# EAGLE design cooling_system (EAGLE 8.4.0)
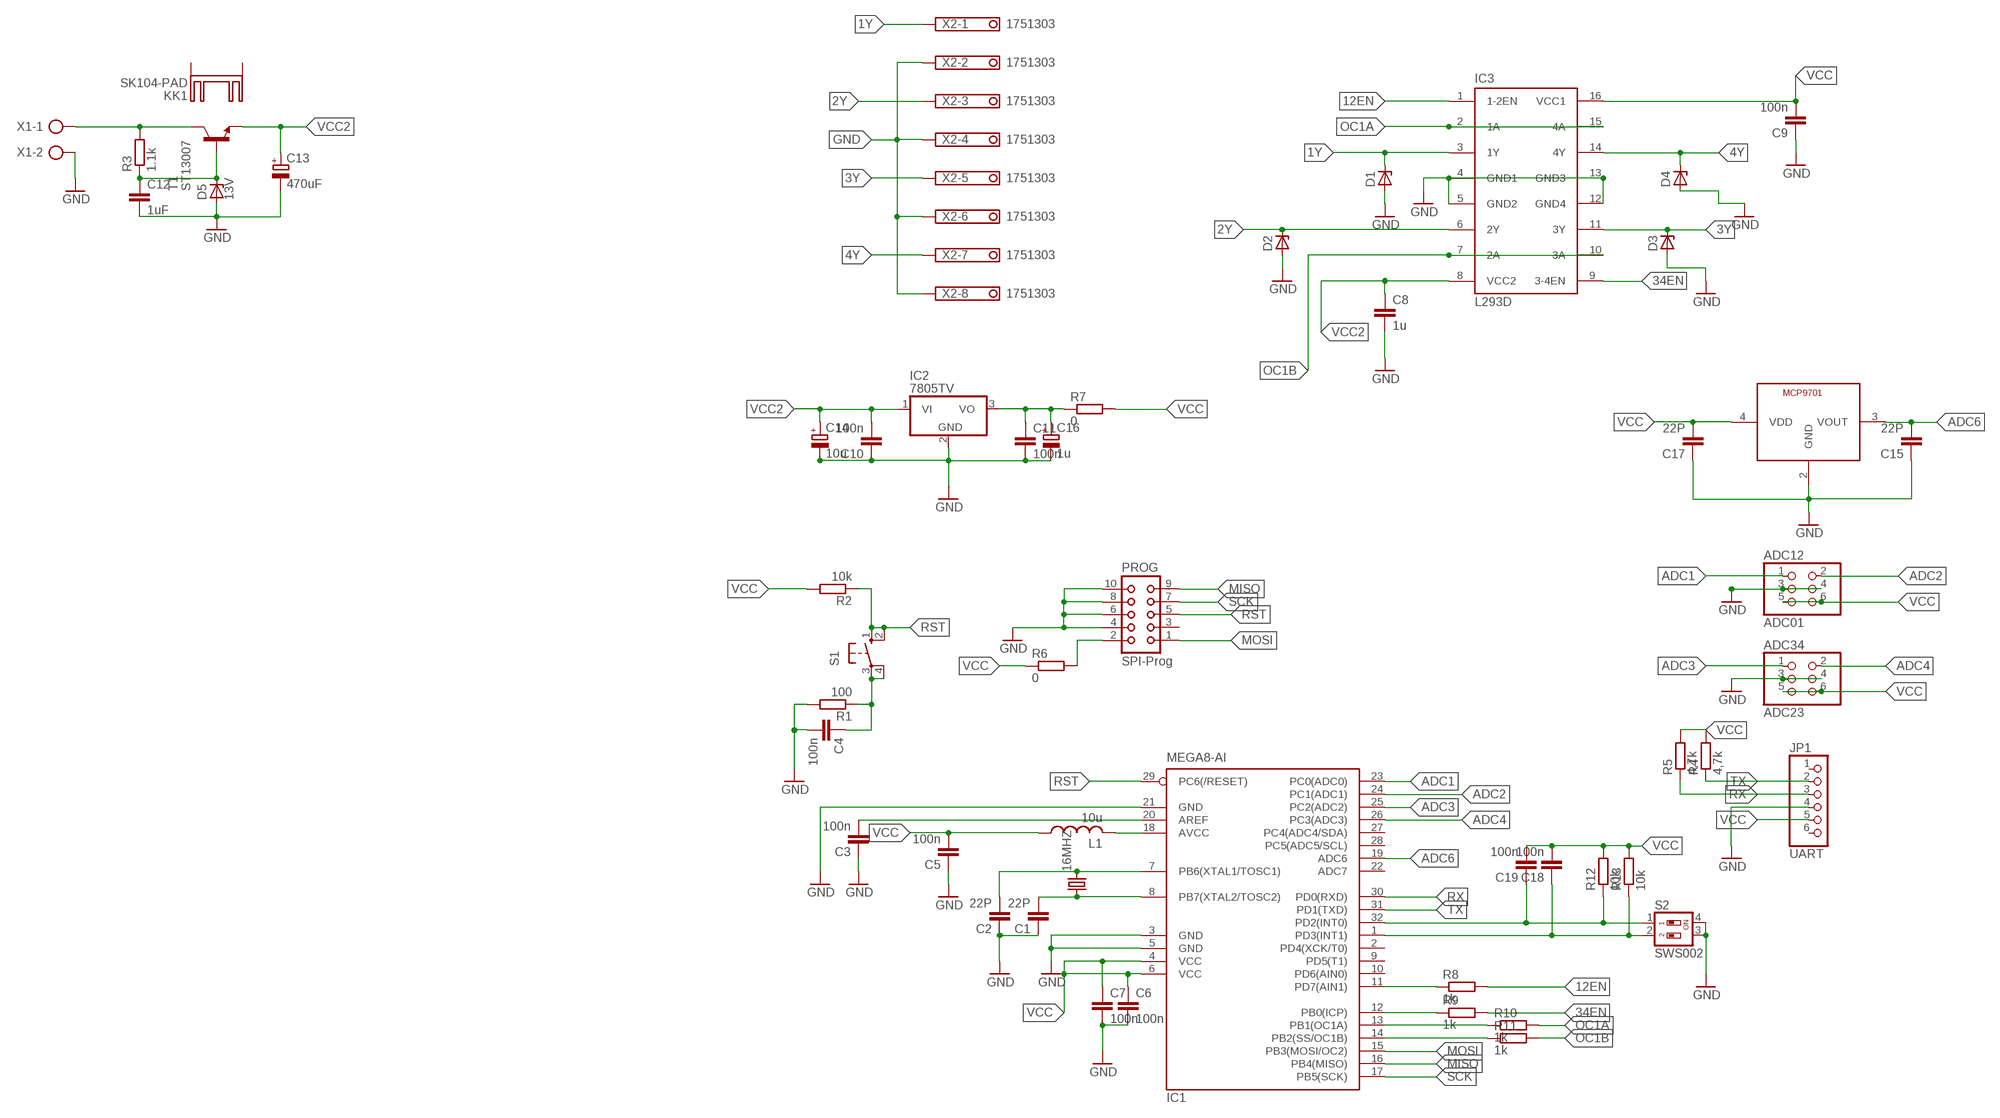
[diagram p0: schematic, sheet 1]

## Parts
16MHZ  CRYSTALHC18U-V  [HC18U-V]
ADC12  ADC01  PINHD-2X3  [2X03]
ADC34  ADC23  PINHD-2X3  [2X03]
C1  22P  C-EUC0805K  [C0805K]
C2  22P  C-EUC0805K  [C0805K]
C3  100n  C-EUC0805K  [C0805K]
C4  100n  C-EUC0805K  [C0805K]
C5  100n  C-EUC0805K  [C0805K]
C6  100n  C-EUC0805K  [C0805K]
C7  100n  C-EUC0805K  [C0805K]
C8  1u  C-EUC0805K  [C0805K]
C9  100n  C-EUC0805K  [C0805K]
C10  100n  C-EUC0805K  [C0805K]
C11  100n  C-EUC0805K  [C0805K]
C12  1uF  C-EUC0805K  [C0805K]
C13  470uF  CPOL-EUE5-10.5  [E5-10,5]
C14  10u  CPOL-EU153CLV-0505  [153CLV-0505]
C15  22P  C-EUC0805K  [C0805K]
C16  1u  CPOL-EU153CLV-0405  [153CLV-0405]
C17  22P  C-EUC0805K  [C0805K]
C18  100n  C-EUC0805K  [C0805K]
C19  100n  C-EUC0805K  [C0805K]
D1  ZENER-DIODEDO35Z10  [DO35Z10]
D2  ZENER-DIODEDO35Z10  [DO35Z10]
D3  ZENER-DIODEDO35Z10  [DO35Z10]
D4  ZENER-DIODEDO35Z10  [DO35Z10]
D5  13V  ZENER-DIODESOT23  [SOT23]
IC1  MEGA8-AI  [TQFP32-08]
IC2  7805TV  [TO220V]
IC3  L293D  [DIL16]
JP1  UART  PINHD-1X6  [1X06]
KK1  SK104-PAD  [SK104-PAD]
L1  10u  L-US0207/10  [0207/10]
PROG  SPI-Prog  CON10  [CON10]
R1  100  R-EU_0207/10  [0207/10]
R2  10k  R-EU_0207/10  [0207/10]
R3  1.1k  R-EU_R0805  [R0805]
R4  4,7k  R-EU_R0805  [R0805]
R5  4,7k  R-EU_R0805  [R0805]
R6  0  R-EU_R0805  [R0805]
R7  0  R-EU_R0805  [R0805]
R8  1k  R-EU_R0805  [R0805]
R9  1k  R-EU_R0805  [R0805]
R10  1k  R-EU_R0805  [R0805]
R11  1k  R-EU_R0805  [R0805]
R12  10k  R-EU_R0805  [R0805]
R13  10k  R-EU_R0805  [R0805]
S1  10-XX  [B3F-10XX]
S2  SWS002  [SMS-002]
T1  ST13007  2SC2509V  [TO220AV]
U$2  MCP9701  [SC70-5L]
X1  AK300/2  [AK300/2]
X2  1751303  [1751303]

## Nets
1Y: D1.C IC3.3(1Y) X2.1
2Y: D2.C IC3.6(2Y) X2.3
3Y: D3.C IC3.11(3Y) X2.5
4Y: D4.C IC3.14(4Y) X2.7
12EN: IC3.1(1-2EN) R8.2
34EN: IC3.9(3-4EN) R9.2
ADC1: ADC12.1 IC1.23(PC0(ADC0))
ADC2: ADC12.2 IC1.24(PC1(ADC1))
ADC3: ADC34.1 IC1.25(PC2(ADC2))
ADC4: ADC34.2 IC1.26(PC3(ADC3))
ADC6: C15.2 IC1.19(ADC6) U$2.3(VOUT)
AREF: C3.2 IC1.20(AREF)
AVCC: IC1.18(AVCC) L1.2
GND: ADC12.3 ADC12.4 ADC34.3 ADC34.4 C1.1 C2.1 C3.1 C4.2 C5.1 C6.2 C7.2 C8.2 C9.1 C10.1 C11.2 C12.2 C13.- C14.- C15.1 C16.- C17.1 D1.A D2.A D3.A D4.A D5.1(A) IC1.3(GND) IC1.5(GND) IC1.21(GND) IC2.2(GND) IC3.4(GND1) IC3.5(GND2) IC3.12(GND4) IC3.13(GND3) JP1.4 PROG.4 PROG.6 PROG.8 PROG.10 R1.2 S2.3 S2.4 U$2.2(GND) X1.2 X2.2 X2.4 X2.6 X2.8
MISO: IC1.16(PB4(MISO)) PROG.9
MOSI: IC1.15(PB3(MOSI/OC2)) PROG.1
N$1: 16MHZ.2 C2.2 IC1.7(PB6(XTAL1/TOSC1))
N$2: 16MHZ.1 C1.2 IC1.8(PB7(XTAL2/TOSC2))
N$3: IC1.14(PB2(SS/OC1B)) R11.1
N$4: IC1.13(PB1(OC1A)) R10.1
N$5: PROG.2 R6.2
N$6: C4.1 R1.1 S1.3(P) S1.4(P1)
N$7: R3.2 T1.2(C) X1.1
N$8: C12.1 D5.3(C) R3.1 T1.1(B)
N$9: IC1.12(PB0(ICP)) R9.1
N$10: IC1.11(PD7(AIN1)) R8.1
N$11: C19.1 IC1.32(PD2(INT0)) R12.1 S2.1
N$12: C18.1 IC1.1(PD3(INT1)) R13.1 S2.2
N$22: C11.1 C16.+ IC2.3(VO) R7.1
OC1A: IC3.2(1A) IC3.15(4A) R10.2
OC1B: IC3.7(2A) IC3.10(3A) R11.2
RST: IC1.29(PC6(/RESET)) PROG.5 R2.1 S1.1(S) S1.2(S1)
RX: IC1.30(PD0(RXD)) JP1.3 R5.1
SCK: IC1.17(PB5(SCK)) PROG.7
TX: IC1.31(PD1(TXD)) JP1.2 R4.1
VCC: ADC12.5 ADC12.6 ADC34.5 ADC34.6 C5.2 C6.1 C7.1 C9.2 C17.2 C18.2 C19.2 IC1.4(VCC) IC1.6(VCC) IC3.16(VCC1) JP1.5 L1.1 R2.2 R4.2 R5.2 R6.1 R7.2 R12.2 R13.2 U$2.4(VDD)
VCC2: C8.1 C10.2 C13.+ C14.+ IC2.1(VI) IC3.8(VCC2) T1.3(E)
Unconnected: IC1.2(PD4(XCK/T0)) IC1.9(PD5(T1)) IC1.10(PD6(AIN0)) IC1.22(ADC7) IC1.27(PC4(ADC4/SDA)) IC1.28(PC5(ADC5/SCL)) JP1.1 JP1.6 KK1.K1(K) KK1.K2(K) PROG.3

## Library data of the parts
16MHZ = crystal:CRYSTAL: CRYSTAL; OC_FARNELL: unknown; OC_NEWARK: unknown
ADC12 ADC34 = pinhead:PINHD-2X3: PIN HEADER
C1-C12 C15 C17-C19 = resistor:C-EU: CAPACITOR, European symbol
C13 C14 C16 = resistor:CPOL-EU: POLARIZED CAPACITOR, European symbol
D1-D5 = diode:ZENER-DIODE: Z-Diode
IC1 = atmel:MEGA8: MICROCONTROLLER 8 Kbytes FLASH, 1 kbytes SRAM, 512 bytes EEPROM, USART, 6-channel 10 bit ADC, 2-channel 8 bit ADC Pin compatible with Atmega48, ATMega88, ATMega168 Source: avr.lbr; MPN: ATMEGA8-16AU; OC_FARNELL: 9171371; OC_NEWARK: 73M8863
IC2 = linear:78*: Positive VOLTAGE REGULATOR Source: http://cache.national.com/ds/LM/LM78L05.pdf http://www.fairchildsemi.com/ds/LM/LM7805.pdf
IC3 = st-microelectronics:L293D: PUSH-PULL 4 CHANNEL DRIVER; MPN: L293D; OC_FARNELL: 9589619; OC_NEWARK: 56P8249
JP1 = pinhead:PINHD-1X6: PIN HEADER
KK1 = heatsink:SK104-PAD: HEATSINK manufacturer Fischer/distributor Buerklin
L1 = resistor:L-US: INDUCTOR, American symbol
PROG = con-harting:CON10: CONNECTOR; OC_FARNELL: unknown; OC_NEWARK: unknown
R1-R13 = resistor:R-EU_: RESISTOR, European symbol
S1 = switch-omron:10-XX: OMRON SWITCH; MPN: B3F-1000; OC_FARNELL: 176432; OC_NEWARK: 36M3542
S2 = smd-special:SWS002: SMD Dip Switch 2 pol.
T1 = transistor:2SC2509: NPN Epitaxial Planar Transistor RF Power Amplivier Source: www.Datasheet4U.com 2SC2905.pdf
U$2 = MCP9701T:MCP9701
X1 = con-ptr500:AK300/2: CONNECTOR; OC_FARNELL: unknown; OC_NEWARK: unknown
X2 = con-phoenix-350:1751303: MKDS 1/ 8-3,5 Printklemme Nennstrom: 10 A Bemessungsspannung: 160 V Raster: 3,5 mm Polzahl: 8 Montageart: Löten Anschlussart: Schraubanschluss Anschlussrichtung vom Leiter zur Platine: 0° Source: http://eshop.phoenixcontact.com .. .pdf; OC_FARNELL: unknown; OC_NEWARK: unknown

## Board
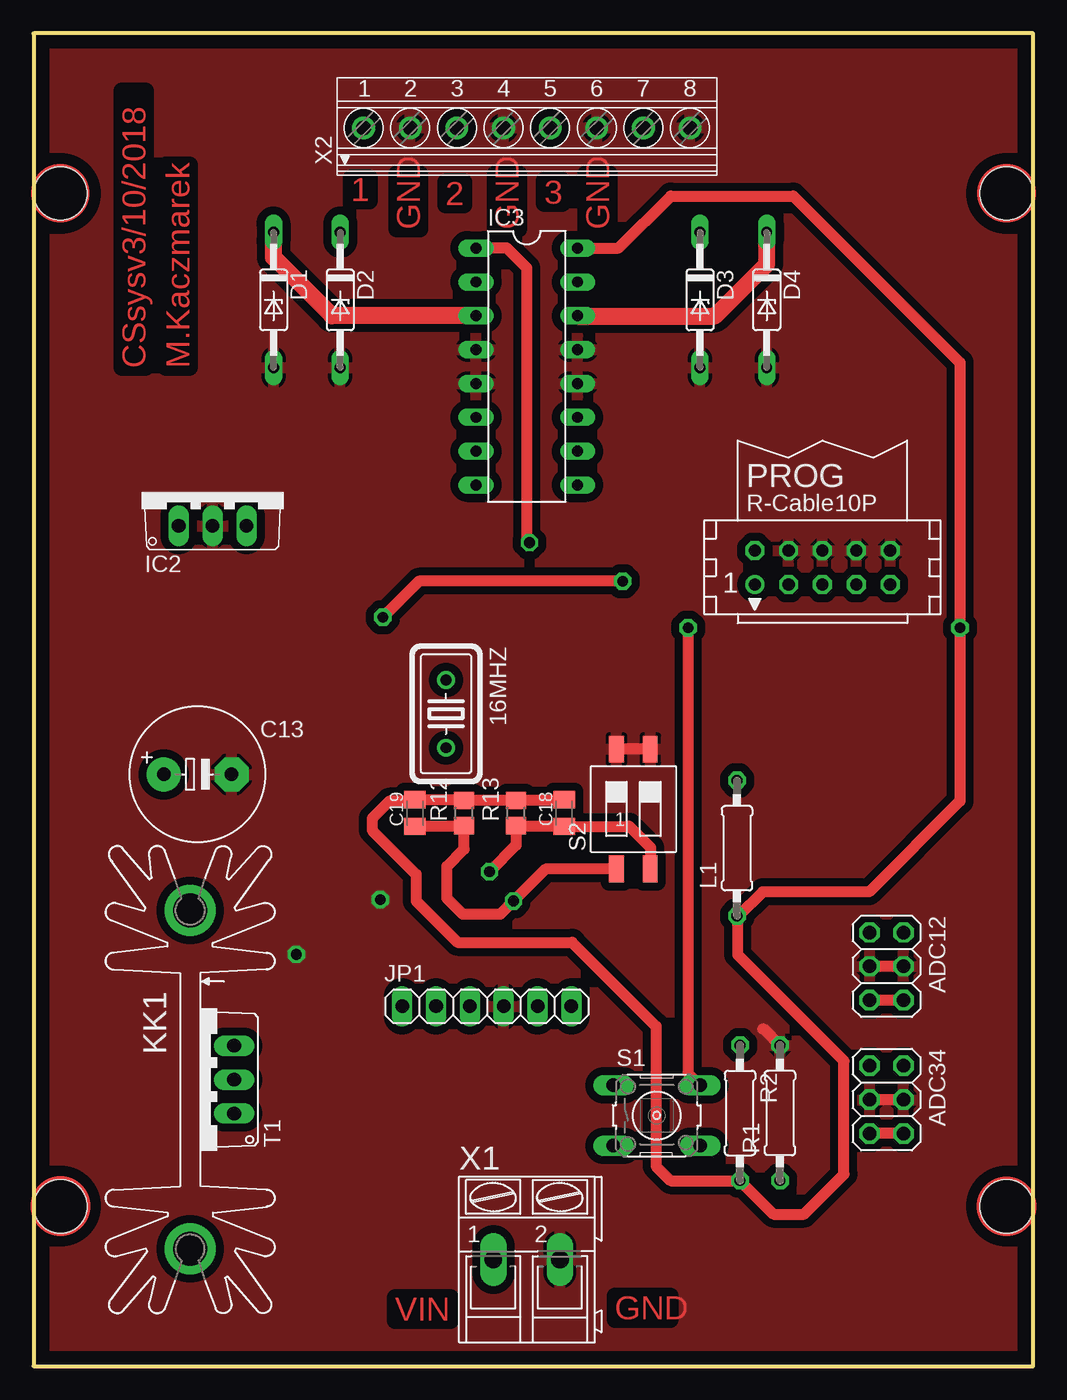
[diagram p1: board, top side]
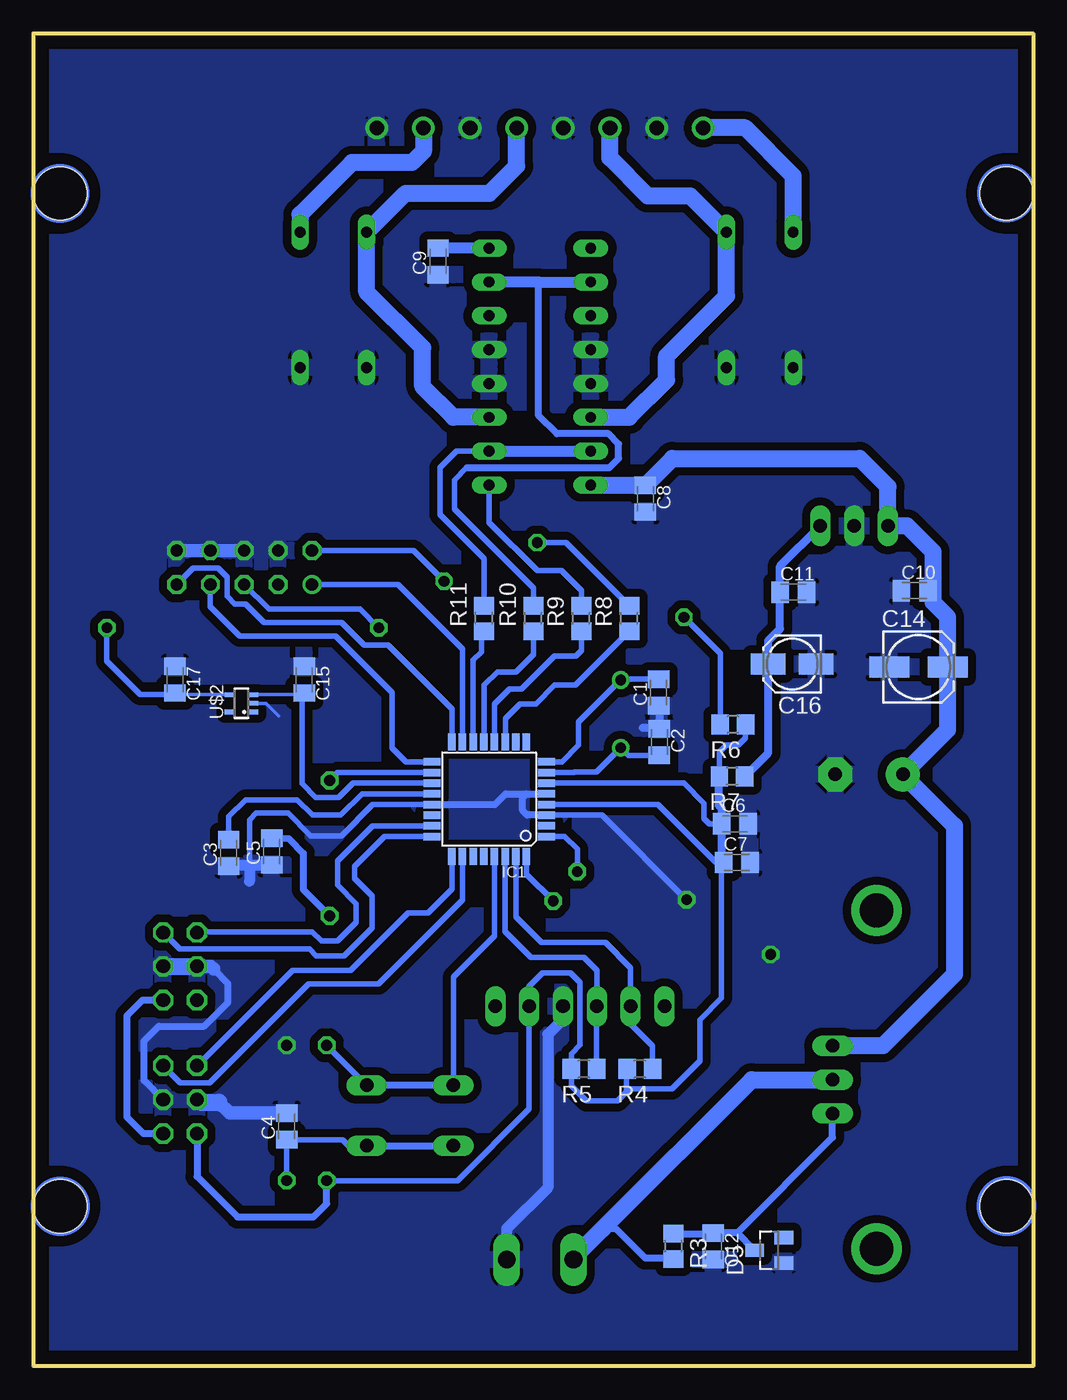
[diagram p2: board, bottom side, seen from below]

Size 75 x 100 mm. Coordinates in mm from the lower left corner, seen from the top.
Outline: 0,0 75,0 75,100 0,100 0,0
Copper layers (1*16): Top 0.035mm / dielectric 1.5mm / Bottom 0.035mm
Design rules "default": minimum track width 6mil, minimum drill 0.35mm, track to track 6mil, track to pad 6mil, pad to pad 6mil, via to via 6mil, smd to smd 6mil, copper to edge 40mil, drill to drill 6mil, minimum pad ring 10mil, minimum via ring 8mil, stop-mask expansion 4mil, vias tented up to drill 0mil, thermal gap 10mil
Holes 4 mm at 2,12 73,12 73,88 2,88

### Footprints (pad centres in the part's own frame; a part is rotated, then mirrored left to right if it is on the bottom)
HC18U-V = drill 0.813: 1 -2.54,0; 2 2.54,0
2X03 = drill 1.016 octagon: 1 -2.54,-1.27; 2 -2.54,1.27; 3 0,-1.27; 4 0,1.27; 5 2.54,-1.27; 6 2.54,1.27
C0805K = smd 1.3 x 1.6: 1 -1,0; 2 1,0
E5-10,5 = drill 1.016 pad 2.54: + -2.54,0 | drill 1.016 pad 2.54 octagon: - 2.54,0
153CLV-0505 = smd 3 x 1.6: + 2.2,0; - -2.2,0
153CLV-0405 = smd 2.6 x 1.6: + 1.8,0; - -1.8,0
DO35Z10 = drill 0.813 long: A 5.08,0; C -5.08,0
SOT23 = smd 1 x 1.4: 1 -0.95,-1.1; 2 0.95,-1.1; 3 0,1.1
TQFP32-08 = smd 1.27 x 0.559: 1 -4.293,2.8; 2 -4.293,2; 3 -4.293,1.2; 4 -4.293,0.4; 5 -4.293,-0.4; 6 -4.293,-1.2; 7 -4.293,-2; 8 -4.293,-2.8; 17 4.293,-2.8; 18 4.293,-2; 19 4.293,-1.2; 20 4.293,-0.4; 21 4.293,0.4; 22 4.293,1.2; 23 4.293,2; 24 4.293,2.8 | smd 0.559 x 1.27: 9 -2.8,-4.293; 10 -2,-4.293; 11 -1.2,-4.293; 12 -0.4,-4.293; 13 0.4,-4.293; 14 1.2,-4.293; 15 2,-4.293; 16 2.8,-4.293; 25 2.8,4.293; 26 2,4.293; 27 1.2,4.293; 28 0.4,4.293; 29 -0.4,4.293; 30 -1.2,4.293; 31 -2,4.293; 32 -2.8,4.293
TO220V = drill 1.016 long: 1 -2.54,-2.54; 2 0,-2.54; 3 2.54,-2.54
DIL16 = drill 0.813 long: 1 -8.89,-3.81; 2 -6.35,-3.81; 3 -3.81,-3.81; 4 -1.27,-3.81; 5 1.27,-3.81; 6 3.81,-3.81; 7 6.35,-3.81; 8 8.89,-3.81; 9 8.89,3.81; 10 6.35,3.81; 11 3.81,3.81; 12 1.27,3.81; 13 -1.27,3.81; 14 -3.81,3.81; 15 -6.35,3.81; 16 -8.89,3.81
1X06 = drill 1.016 long: 1 -6.35,0; 2 -3.81,0; 3 -1.27,0; 4 1.27,0; 5 3.81,0; 6 6.35,0
SK104-PAD = drill 2.54 pad 3.81: K1 -12.7,-0.762; K2 12.7,-0.762
0207/10 = drill 0.813 octagon: 1 -5.08,0; 2 5.08,0
CON10 = drill 0.914: 1 -5.08,-1.27 | drill 0.914 octagon: 2 -5.08,1.27; 3 -2.54,-1.27; 4 -2.54,1.27; 5 0,-1.27; 6 0,1.27; 7 2.54,-1.27; 8 2.54,1.27; 9 5.08,-1.27; 10 5.08,1.27
R0805 = smd 1.3 x 1.5: 1 -0.95,0; 2 0.95,0
B3F-10XX = drill 1.016 long: 1 -3.251,2.261; 2 3.251,2.261; 3 -3.251,-2.261; 4 3.251,-2.261
SMS-002 = smd 1.092 x 2.007: 1 -1.27,-4.496; 2 1.27,-4.496; 3 1.27,4.496; 4 -1.27,4.496
TO220AV = drill 1.016 long: 1 -2.54,-2.54; 2 0,-2.54; 3 2.54,-2.54
SC70-5L = smd 0.35 x 0.8: 1 -0.65,-0.85; 2 0,-0.85; 3 0.65,-0.85; 4 0.65,0.85; 5 -0.65,0.85
AK300/2 = drill 1.321 long: 1 -2.515,0; 2 2.489,0
1751303 = drill 1.1 pad 1.7: 1 -12.25,-0.1; 2 -8.75,-0.1; 3 -5.25,-0.1; 4 -1.75,-0.1; 5 1.75,-0.1; 6 5.25,-0.1; 7 8.75,-0.1; 8 12.25,-0.1

### Placement (x,y rotation side)
16MHZ  30.94,48.94 270 top
ADC12  64,30 270 top
ADC34  64,20 270 top
C1  28.09,50.54 90 bottom
C2  28.04,46.83 270 bottom
C3  60.36,38.51 90 bottom
C4  56,18 90 bottom
C5  57.12,38.61 90 bottom
C6  22.37,40.7 0 bottom
C7  22.22,37.8 0 bottom
C8  29.09,65.08 270 bottom
C9  44.65,82.88 90 bottom
C10  8.88,58.18 0 bottom
C11  17.98,58.08 0 bottom
C12  24,9 270 bottom
C13  12.3,44.4 0 top
C14  8.6,52.46 0 bottom
C15  54.68,51.51 270 bottom
C16  18.07,52.68 180 bottom
C17  64.39,51.51 270 bottom
C18  39.8,41.5 90 top
C19  28.6,41.5 90 top
D1  18,80 270 top
D2  23,80 270 top
D3  50,80 270 top
D4  55,80 270 top
D5  19.8,8.7 90 bottom
IC1  40.81,42.54 180 bottom
IC2  13.42,65.59 0 top
IC3  37,75 270 top
JP1  34,27 0 top
KK1  12.5,21.5 270 top
L1  52.78,38.86 90 top
PROG  59.19,59.92 0 top
R1  56,19 90 top
R2  53,19 270 top
R3  27,9 270 bottom
R4  29.5,22.3 180 bottom
R5  33.7,22.3 180 bottom
R6  22.52,48.14 180 bottom
R7  22.58,44.25 180 bottom
R8  30.3,56.1 90 bottom
R9  33.9,56.1 90 bottom
R10  37.5,56.1 90 bottom
R11  41.2,56.1 90 bottom
R12  32.3,41.5 90 top
R13  36.2,41.5 90 top
S1  46.75,18.81 0 top
S2  45,41.8 0 top
T1  12.5,21.5 90 top
U$2  59.41,49.73 90 bottom
X1  37,8 0 top
X2  37,93 0 top

### Tracks (layer width: path | path; a pad name or v marks a point on that pad's centre or on a via)
1Y
  Top 1.27: IC3.3 22.39,78.81 18,83.2 D1.C
  Bottom 1.27: D1.C 18,89.3 21.6,92.9 X2.1
2Y
  Bottom 1.27: IC3.6 30.31,71.19 27.5,74 27.5,75.8 23,80.3 D2.C 25.72,87.8 28.9,87.8 31.75,90.65 X2.3
3Y
  Bottom 1.27: IC3.11 43.49,71.19 45.8,73.5 45.8,76.4 50,80.6 D3.C 47.08,88 40.8,88 38.75,90.05 X2.5
4Y
  Top 1.27: IC3.14 51.1,78.8 55,82.7 D4.C
  Bottom 1.27: D4.C 55,86.4 51.1,90.3 46.6,90.3 45.75,91.15 X2.7
12EN  (via drill 0.8 pad 1.3)
  Top 0.813: v37.2,61.8 37.01,61.99 37.01,82.4 35.51,83.89 IC3.1
  Bottom 0.406: R8.2 35.05,61.8 v37.2,61.8
34EN
  Bottom 0.406: R9.2 33.9,58.2 35.4,59.7 37.2,59.7 40.81,63.31 IC3.9
ADC1
  Bottom 0.406: ADC12.1 62.67,32.6 54.1,32.6 53.4,31.9 52.2,31.9 50.8,33.3 50.8,34.7 52.2,36.1 52.2,37.9 49.56,40.54 IC1.23
ADC2
  Bottom 0.406: ADC12.2 64.03,31.3 54.3,31.3 53.8,30.8 51.7,30.8 49.6,32.9 49.6,35.3 50.9,36.6 50.9,37.5 48.66,39.74 IC1.24
ADC3
  Bottom 0.406: ADC34.1 55.57,29.7 51.2,29.7 46.9,34 45.4,34 43.61,35.79 IC1.25
ADC4
  Bottom 0.406: ADC34.2 63.99,21.26 61.8,21.26 54.35,28.7 49.1,28.7 | 49.3,28.7 49.1,28.7 | 43.05,34.75 49.1,28.7 | 43.05,34.75 43,34.8 | IC1.26 42.81,34.99 43.05,34.75
ADC6
  Bottom 0.254: U$2.3 54.94,50.38 54.86,50.3
  Bottom 0.406: IC1.19 51.02,43.74 52.09,42.67 53.82,42.67 54.86,43.71 54.86,50.3 54.86,50.38 | 54.86,50.38 54.72,50.53 C15.2 | 54.86,50.38
AREF
  Bottom 0.406: IC1.20 50.35,42.94 51.94,41.35 54.07,41.35 55.22,42.5 59.1,42.5 60.36,41.24 C3.2
AVCC
  Bottom 0.406: IC1.18 52.18,44.54 L1.2
GND  (via drill 0.8 pad 1.3)
  Top 0.813: S2.3 S2.4 | R1.2 54.78,25.3 54.7,25.3 | ADC12.4 ADC12.3 | ADC34.4 ADC34.3
  Bottom 0.254: U$2.2 57.53,49.73 56.6,48.8
  Bottom 0.406: IC1.21 49.56,42.14 51.9,39.8 54.2,39.8 55.9,41.5 58.3,41.5 58.8,41 58.8,37.61 | 36.58,41.4 IC1.3 32.34,41.34 v26,35 | C5.1 58.8,37.61 | 58.8,37.61 60.25,37.61
  Bottom 0.508: 38.01,42.94 IC1.5 | 38.01,42.94 38.3,42.65 38.3,41.68 37.96,41.34 IC1.3 | IC1.21 40.38,42.14 39.58,42.94 38.01,42.94 | ADC34.4 66.7,21.43 66.7,24.4 65.6,25.5 62.2,25.5 60.4,27.3 60.4,28.7 61.5,29.8 | 61.7,30 62.5,30 ADC12.3
  Bottom 0.61: C1.1 28.04,49.49 C2.1 28.11,47.9 29.3,47.9
  Bottom 0.813: 58.8,37.61 58.8,36.4 | C3.1 60.25,37.61 C5.1 | JP1.4 35.27,26.03 36.4,24.9 36.4,13.4 39.49,10.31 X1.2
  Bottom 1.016: PROG.6 PROG.8 PROG.10 | ADC12.3 61.7,30 61.5,29.8 | 61.1,19.8 60.3,19 C4.2
  Bottom 1.27: ADC34.3 62.53,19.8 61.1,19.8 | ADC12.4 62.5,30
  other vias: 19.7,30.9
  pour Bottom (isolate 0.61): 0,0 0,100 75,100 75,0
  pour Top (isolate 0.61): 0,0 0,100 75,100 75,0
MISO
  Bottom 0.406: IC1.16 43.61,49.31 48.4,54.1 50.2,54.1 51.9,55.8 57.7,55.8 59.1,57.2 59.9,57.2 60.48,57.77 60.48,59.21 61.16,59.89 63.03,59.89 PROG.9
MOSI
  Bottom 0.406: IC1.15 42.81,53.81 47.65,58.65 PROG.1
N$1
  Bottom 0.406: IC1.7 34.46,44.54 34.4,44.6 32.74,44.6 16MHZ.2 30.37,45.83 C2.2
N$2
  Bottom 0.406: IC1.8 35.36,45.34 34.1,46.6 34.1,48.32 16MHZ.1 30.88,51.54 C1.2
N$3
  Bottom 0.406: IC1.14 42.01,52.99 41.4,53.6 41.4,54.95 R11.1
N$4
  Bottom 0.406: IC1.13 41.21,51.09 40.2,52.1 38.8,52.1 37.5,53.4 R10.1
N$5  (via drill 0.8 pad 1.3)
  Top 0.813: v44.2,58.9 28.9,58.9 v26.2,56.2
  Bottom 0.406: PROG.2 46.49,61.19 v44.2,58.9 | v26.2,56.2 23.47,53.47 R6.2
N$6
  Bottom 0.406: S1.4 51.35,16.55 51.8,17 C4.1 R1.1
  Bottom 0.508: S1.4 S1.3
N$7
  Bottom 0.508: R3.2 27.05,8.1 29.1,8.1 31.3,10.3 32.3,10.3
  Bottom 1.27: X1.1 34.48,8.12 32.3,10.3 21.1,21.5 T1.2
N$8
  Bottom 0.508: C12.1 24.15,10.05 | R3.1 24.05,9.95 C12.1 | D5.3 22.2,10 | 22.2,10 C12.1 | T1.1 15.04,17.16 22.2,10
N$9
  Bottom 0.406: IC1.12 40.4,46.84 40.4,49.7 39.3,50.8 38.4,50.8 35.9,53.3 34.3,53.3 33.9,53.7 R9.1
N$10
  Bottom 0.406: R8.1 34.35,51.1 35.9,51.1 37.3,49.7 38.5,49.7 39.6,48.6 39.6,46.84 IC1.11
N$11  (via drill 0.8 pad 1.3)
  Top 0.813: S2.1 38.4,37.3 v36,34.9 35,33.9 32.2,33.9 31,35.1 31,37.5 32.3,38.8 R12.1 32.25,40.5 C19.1
  Bottom 0.406: v36,34.9 38.01,36.91 IC1.32
N$12  (via drill 0.8 pad 1.3)
  Top 0.813: S2.2 46.3,37.33 46.3,38.9 44.7,40.5 C18.1 | 39.95,40.55 C18.1 | C18.1 36.25,40.5 R13.1 36.2,39.1 v34.2,37.1
  Bottom 0.406: v34.2,37.1 34.2,38.8 35.14,39.74 IC1.1
N$22
  Bottom 0.61: R7.1 19.87,46.01 C16.+ 19.87,54.43 18.98,55.32 C11.1 18.98,60.03 IC2.3
OC1A
  Bottom 0.406: 42.5,67.4 43.4,66.5 43.4,64.3 37.5,58.4 R10.2
  Bottom 0.508: 42.5,67.4 31.8,67.4 31.1,68.1 31.1,69.2 31.85,69.95 35.73,69.95 37.1,71.32 37.1,81.35
  Bottom 0.813: IC3.15 37.1,81.35 IC3.2
OC1B
  Bottom 0.406: IC3.10 43.25,68.65 44.5,67.4 44.5,63.9 41.2,60.6 R11.2
  Bottom 0.813: IC3.10 IC3.7
RST  (via drill 0.8 pad 1.3)
  Top 0.813: v49.1,55.4 49.1,21.97 S1.2
  Bottom 0.406: S1.1 43.5,29.2 40.41,32.29 IC1.29 | PROG.5 57.34,56.8 50.5,56.8 v49.1,55.4 | S1.2 53,24.07 R2.1
  Bottom 0.508: S1.1 S1.2
RX
  Bottom 0.406: IC1.30 39.61,32.6 37.66,30.66 33.68,30.66 32.73,29.71 JP1.3 32.7,26.97 32.75,26.92 R5.1
SCK
  Bottom 0.406: PROG.7 61.73,56.98 59.53,54.79 52.35,54.79 48.1,50.54 48.1,46.4 47.04,45.34 IC1.17
TX
  Bottom 0.406: IC1.31 38.81,33.71 36.9,31.8 32.1,31.8 30.19,29.89 JP1.2 30.19,25.69 28.55,24.05 R4.1
VCC  (via drill 0.8 pad 1.3)
  Top 0.406: 52.83,33.73 L1.1
  Top 0.813: IC3.16 43.89,83.89 47.8,87.8 57,87.8 69.5,75.3 v69.5,55.4 69.5,42.4 62.7,35.6 54.7,35.6 52.83,33.73 52.83,30.87 60.8,22.9 60.8,14.4 57.8,11.4 55.52,11.4 R2.2 47.78,13.92 46.7,15 46.7,25.5 40.4,31.8 31.8,31.8 28.7,34.9 28.7,36.9 25.4,40.2 25.4,41.1 26.7,42.4 28.5,42.4 C19.2 32.25,42.5 R12.2 R13.2 39.75,42.45 C18.2 | ADC34.6 ADC34.5 | ADC12.6 ADC12.5
  Bottom 0.254: U$2.4 64.21,50.38
  Bottom 0.406: 64.21,50.38 64.36,50.49 | 64.36,50.49 C17.2 | IC1.6 26.21,43.74 24.7,42.23 24.7,41.1 24.3,40.7 C6.1 | IC1.4 28.14,42.14 23.8,37.8 23.3,37.8 | R2.2 52.98,13.9 43.2,13.9 37.81,19.29 JP1.5 37.81,28.49 36.8,29.5 34.7,29.5 34,28.8 34,24.1 34.65,23.45 R5.2 34.65,21.05 33.5,19.9 31.2,19.9 30.5,20.6 | v69.5,55.4 69.5,52.9 67,50.4 64.45,50.4 64.36,50.49 | R4.2 30.5,22.25 30.5,20.6 | 30.5,20.6 30.3,20.8 27.1,20.8 25,22.9 25,26 23.38,27.62 23.38,37.72 23.3,37.8 | 23.3,37.8 C7.1 | R6.1 21.57,47.13 22.1,46.6 23,46.6 23.53,46.07 R7.2
  Bottom 0.508: IC1.6 | C5.2 55.84,39.56 54.76,38.48 54.76,35.76 L1.1 | ADC34.5 62.73,14.23 59.7,11.2 54,11.2 53,12.2 R2.2 | ADC34.6 66.76,17.46 68,18.7 68,26.3 66.84,27.46 ADC12.6
  Bottom 0.61: C6.1 23.33,40.94 | C6.1 23.37,37.95 C7.1 | R7.2 23.6,44.18 23.6,42.1 23.37,41.87 C6.1
  Bottom 0.813: IC3.16 44.63,83.89 C9.2
VCC2
  Bottom 1.27: T1.3 11.26,24.04 5.9,29.4 5.9,40.54 C13.+ 6.4,47.76 C14.+ 6.4,56.2 7.5,57.3 7.5,58.56 | IC3.8 29.12,66.11 C8.1 27.07,68.1 13,68.1 10.88,65.98 IC2.1 9.45,63.05 7.5,61.1 7.5,58.56 | 7.5,58.56 C10.2
(copper drawn outside any net)
  shapes: Bottom circle x4, Top circle x4

### Text on the board
Top: 1 | 2 | 3 | GND | GND | GND | CSsysv3/10/2018 | M.Kaczmarek | GND | VIN